# EAGLE design midi_in (EAGLE 9.6.2)
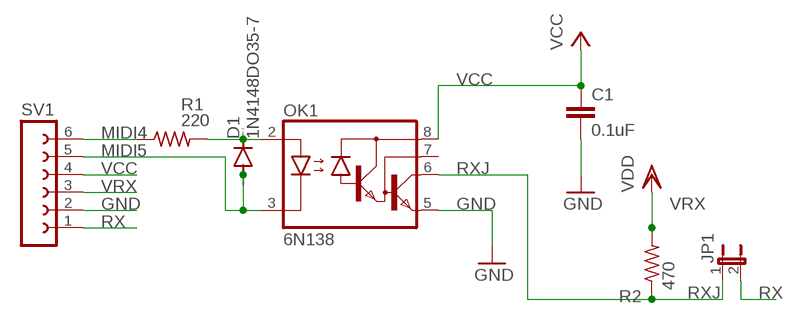
[diagram p0: schematic, sheet 1]

## Parts
C1  0.1uF  C10/5  [C10B5]
D1  1N4148DO35-7  [DO35-7]
JP1  JP1E  [JP1]
OK1  6N138  [DIL08]
R1  220  R-US_0207/10  [0207/10]
R2  470  R-US_0207/10  [0207/10]
SV1  FE06-1  [FE06]

## Nets
GND: C1.2 OK1.5(GND) SV1.2
MIDI4: R1.1 SV1.6
MIDI5: D1.A OK1.3(C) SV1.5
N$8: D1.C OK1.2(A) R1.2
RX: JP1.2 SV1.1
RXJ: JP1.1 OK1.6(VO) R2.1
VCC: C1.1 OK1.8(VCC) SV1.4
VRX: R2.2 SV1.3 ; supply symbol labelled VDD
Unconnected: OK1.7(VB)

## Library data of the parts
C1 = capacitor-wima:C: CAPACITOR naming: grid - package width
D1 = diode:1N4148: DIODE high speed (Philips)
JP1 = jumper:JP1E: JUMPER
OK1 = optocoupler:6N138: MOTOROLA OPTO COUPLER; MF: VISHAY/TELEFUNKEN; MPN: 6N138; OC_FARNELL: 9860150; OC_NEWARK: 35K5294
R1 R2 = rcl:R-US_: RESISTOR, American symbol; SPICEPREFIX: R
SV1 = con-lsta:FE06-1: FEMALE HEADER; OC_FARNELL: unknown; OC_NEWARK: unknown

## Board
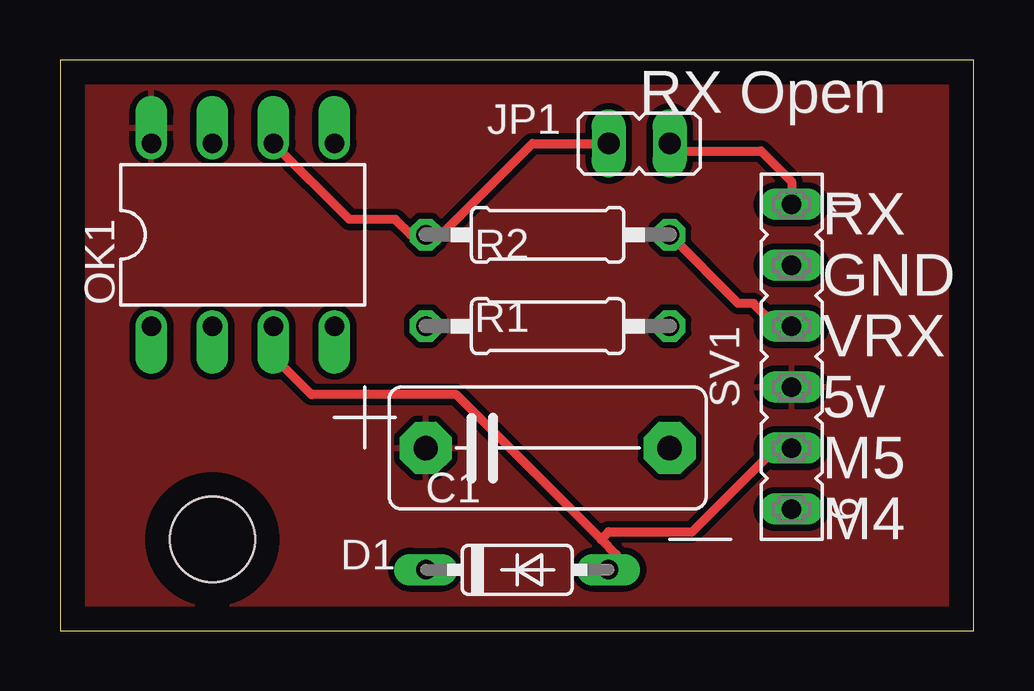
[diagram p1: board, top side]
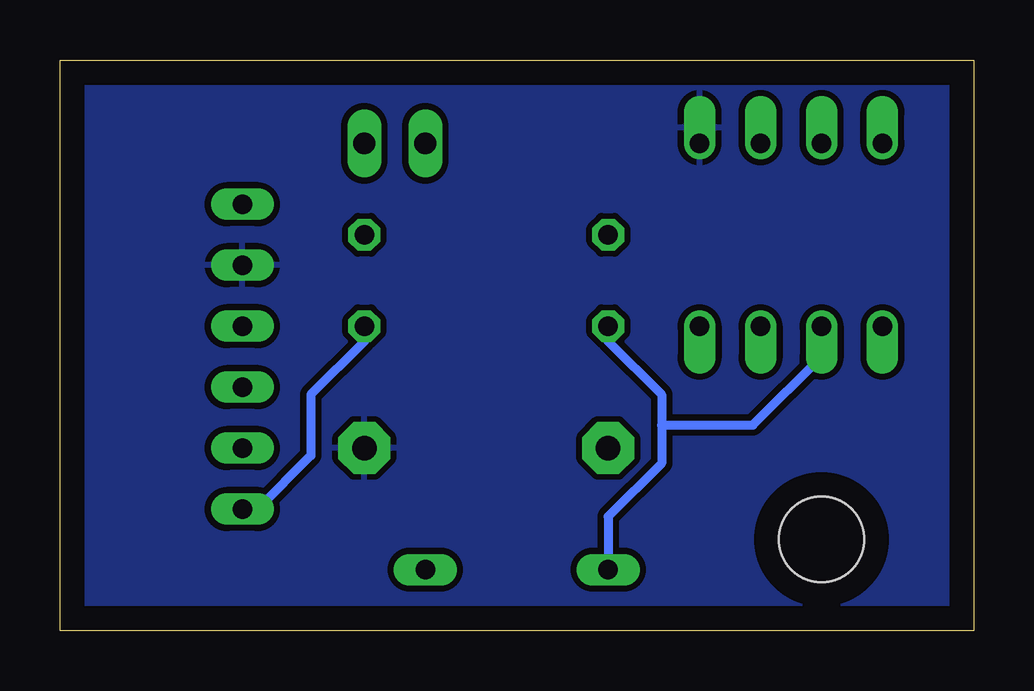
[diagram p2: board, bottom side, seen from below]

Size 38.08 x 23.8 mm. Coordinates in mm from the lower left corner, seen from the top.
Outline: 0,0 38.08,0 38.08,23.8 0,23.8 0,0
Copper layers (1*16): Top 0.035mm / dielectric 1.5mm / Bottom 0.035mm
Design rules "default *": minimum track width 15mil, minimum drill 0.35mm, track to track 10mil, track to pad 10mil, pad to pad 10mil, via to via 10mil, smd to smd 10mil, copper to edge 40mil, drill to drill 6mil, minimum pad ring 10mil, minimum via ring 8mil, stop-mask expansion 4mil, vias tented up to drill 0mil, thermal gap 10mil
Holes 3.56 mm at 6.35,3.81

### Footprints (pad centres in the part's own frame; a part is rotated, then mirrored left to right if it is on the bottom)
C10B5 = drill 1.016 pad 2.159 octagon: 1 -5.08,0; 2 5.08,0
DO35-7 = drill 0.813 long: A 3.81,0; C -3.81,0
JP1 = drill 0.914 long: 1 0,-1.27; 2 0,1.27
DIL08 = drill 0.813 offset: 1 -3.81,-3.81; 2 -1.27,-3.81; 3 1.27,-3.81; 4 3.81,-3.81; 5 3.81,3.81; 6 1.27,3.81; 7 -1.27,3.81; 8 -3.81,3.81
0207/10 = drill 0.813 octagon: 1 -5.08,0; 2 5.08,0
FE06 = drill 0.813 long: 1 -6.35,0; 2 -3.81,0; 3 -1.27,0; 4 1.27,0; 5 3.81,0; 6 6.35,0

### Placement (x,y rotation side)
C1  20.32,7.62 0 top
D1  19.05,2.54 0 top
JP1  24.13,20.32 270 top
OK1  7.62,16.51 0 top
R1  20.32,12.7 180 top
R2  20.32,16.51 0 top
SV1  30.48,11.43 270 top

### Tracks (layer width: path | path; a pad name or v marks a point on that pad's centre or on a via)
GND
  pour Bottom: 0,24.13 39.37,24.13 39.37,0 0,0
MIDI4
  Bottom 0.381: SV1.6 29.84,5.08 27.62,7.3 27.62,9.84 25.4,12.06 R1.1
MIDI5
  Top 0.381: OK1.3 8.89,11.43 10.48,9.84 16.51,9.84 22.54,3.81 | 22.54,3.81 23.18,3.17 23.18,2.86 D1.A | SV1.5 29.84,7.62 26.35,4.13 22.86,4.13 22.54,3.81
N$8
  Bottom 0.381: D1.C 15.24,4.76 13.02,6.99 13.02,8.57 | 13.02,8.57 13.02,9.84 15.24,12.06 R1.2 | OK1.2 6.35,11.43 9.21,8.57 13.02,8.57
RX
  Top 0.381: SV1.1 30.48,18.73 29.21,20 25.72,20 JP1.2
RXJ
  Top 0.381: OK1.6 12.06,17.14 13.97,17.14 14.61,16.51 R2.1 15.88,16.51 19.68,20.32 JP1.1
VCC
  pour Top: 0,22.86 39.37,22.86 39.37,0 38.1,0 0,0
VRX
  Top 0.381: R2.2 28.26,13.65 28.89,13.65 29.84,12.7 SV1.3

### Text on the board
tPlace: RX Open | RX | GND | VRX | 5v | M5 | M4